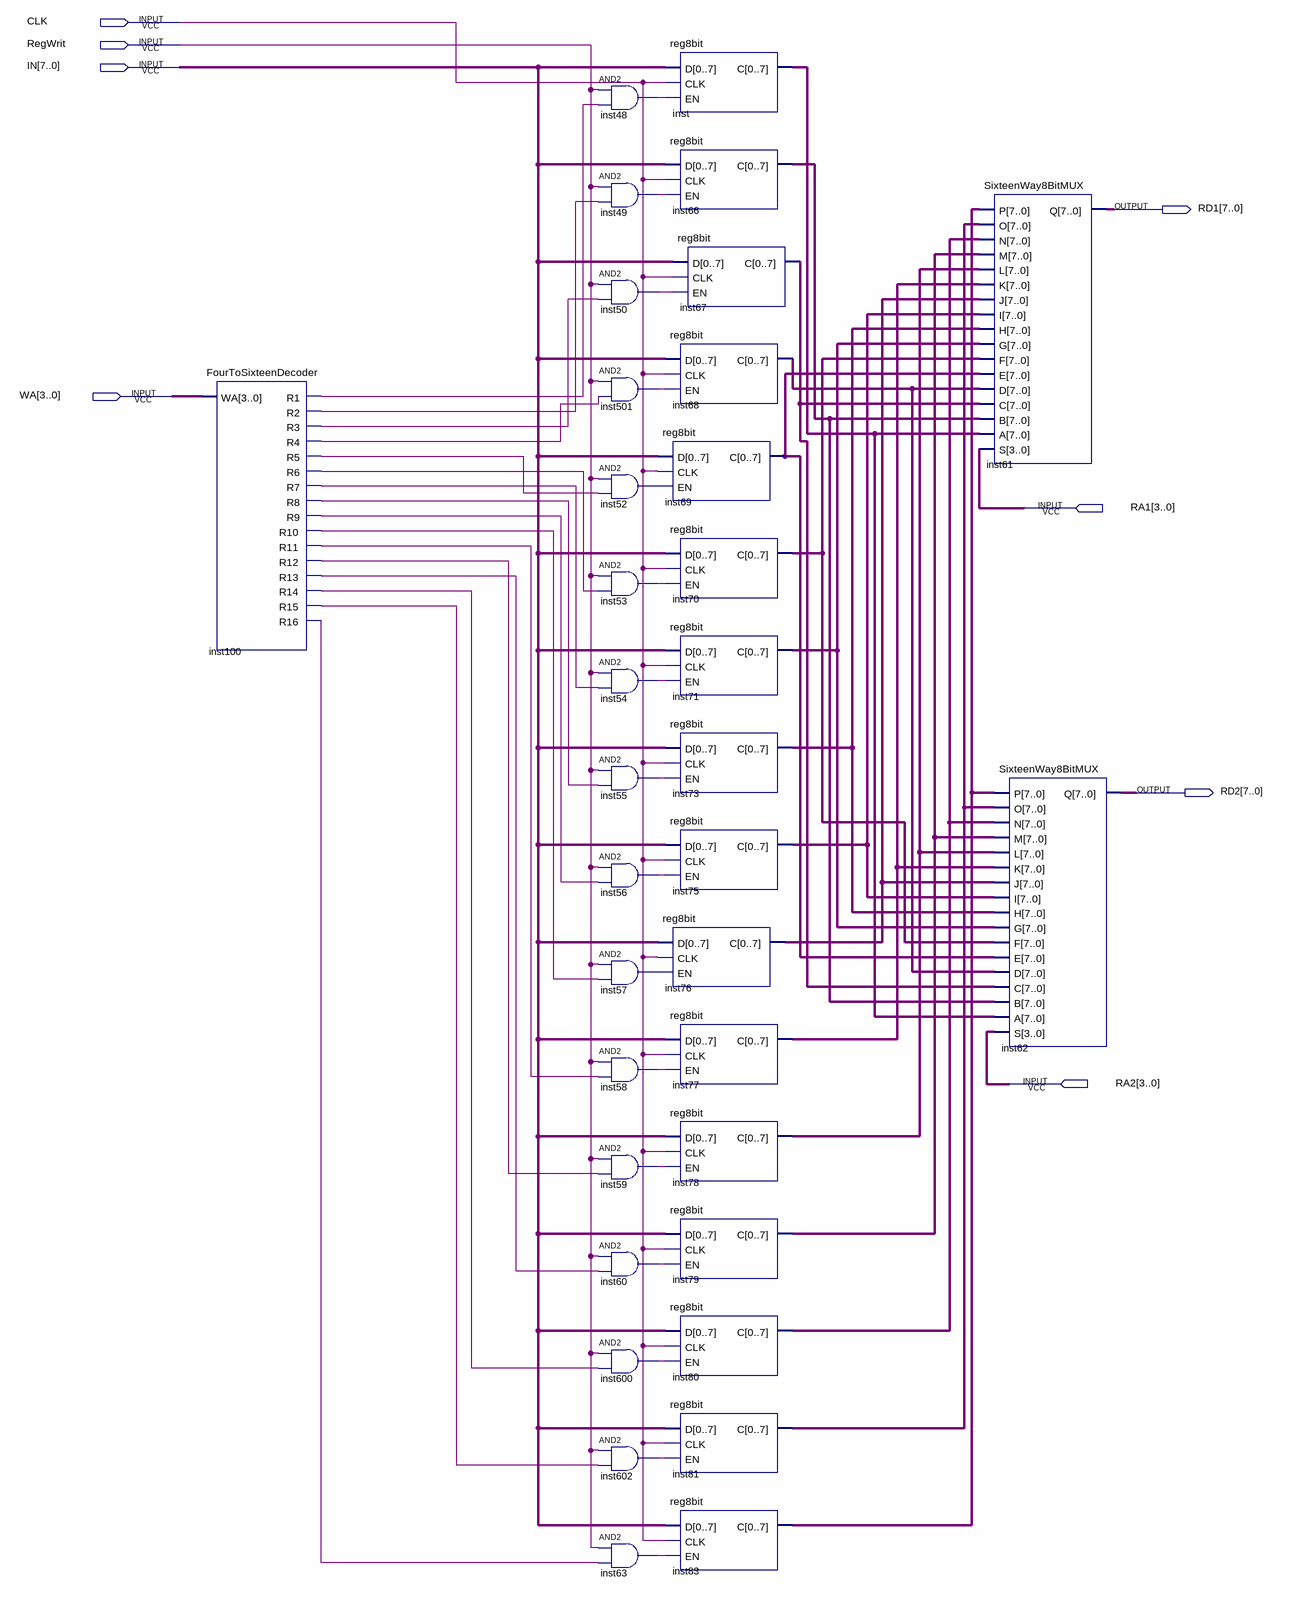
[diagram p0: schematic sheet]
// Quartus schematic SixteenByEightRF.bdf as structural Verilog: 35 symbols, 8 pins
module SixteenByEightRF (
  input  CLK,
  input  RegWrit,
  input  [7:0] IN,
  input  [3:0] WA,
  input  [3:0] RA1,
  input  [3:0] RA2,
  output [7:0] RD1,
  output [7:0] RD2
);

  wire inst48_out, inst49_out, inst50_out, inst52_out, inst53_out, inst54_out, inst55_out, inst56_out,
       inst57_out, inst58_out, inst59_out, inst60_out, inst63_out, inst100_r1, inst100_r2, inst100_r3,
       inst100_r4, inst100_r5, inst100_r6, inst100_r7, inst100_r8, inst100_r9, inst100_r10, inst100_r11,
       inst100_r12, inst100_r13, inst100_r14, inst100_r15, inst100_r16, inst501_out, inst600_out, inst602_out;
  wire [7:0] inst66_c, inst67_c, inst68_c, inst69_c, inst70_c, inst71_c, inst73_c, inst75_c, inst76_c,
       inst77_c, inst78_c, inst79_c, inst80_c, inst81_c, inst83_c, inst_c;

  FourToSixteenDecoder inst100 (
    .WA(WA), .R1(inst100_r1), .R2(inst100_r2), .R3(inst100_r3), .R4(inst100_r4), .R5(inst100_r5),
    .R6(inst100_r6), .R7(inst100_r7), .R8(inst100_r8), .R9(inst100_r9), .R10(inst100_r10), .R11(inst100_r11),
    .R12(inst100_r12), .R13(inst100_r13), .R14(inst100_r14), .R15(inst100_r15), .R16(inst100_r16));
  and inst48 (inst48_out, RegWrit, inst100_r1);
  and inst49 (inst49_out, RegWrit, inst100_r2);
  and inst50 (inst50_out, RegWrit, inst100_r3);
  and inst501 (inst501_out, RegWrit, inst100_r4);
  and inst52 (inst52_out, RegWrit, inst100_r5);
  and inst53 (inst53_out, RegWrit, inst100_r6);
  and inst54 (inst54_out, RegWrit, inst100_r7);
  and inst55 (inst55_out, RegWrit, inst100_r8);
  and inst56 (inst56_out, RegWrit, inst100_r9);
  and inst57 (inst57_out, RegWrit, inst100_r10);
  and inst58 (inst58_out, RegWrit, inst100_r11);
  and inst59 (inst59_out, RegWrit, inst100_r12);
  and inst60 (inst60_out, RegWrit, inst100_r13);
  and inst600 (inst600_out, RegWrit, inst100_r14);
  and inst602 (inst602_out, RegWrit, inst100_r15);
  and inst63 (inst63_out, RegWrit, inst100_r16);
  reg8bit inst69 (.D(IN), .CLK(CLK), .EN(inst52_out), .C(inst69_c));
  reg8bit inst76 (.D(IN), .CLK(CLK), .EN(inst57_out), .C(inst76_c));
  reg8bit inst (.D(IN), .CLK(CLK), .EN(inst48_out), .C(inst_c));
  reg8bit inst66 (.D(IN), .CLK(CLK), .EN(inst49_out), .C(inst66_c));
  reg8bit inst67 (.D(IN), .CLK(CLK), .EN(inst50_out), .C(inst67_c));
  reg8bit inst68 (.D(IN), .CLK(CLK), .EN(inst501_out), .C(inst68_c));
  reg8bit inst70 (.D(IN), .CLK(CLK), .EN(inst53_out), .C(inst70_c));
  reg8bit inst71 (.D(IN), .CLK(CLK), .EN(inst54_out), .C(inst71_c));
  reg8bit inst73 (.D(IN), .CLK(CLK), .EN(inst55_out), .C(inst73_c));
  reg8bit inst75 (.D(IN), .CLK(CLK), .EN(inst56_out), .C(inst75_c));
  reg8bit inst77 (.D(IN), .CLK(CLK), .EN(inst58_out), .C(inst77_c));
  reg8bit inst78 (.D(IN), .CLK(CLK), .EN(inst59_out), .C(inst78_c));
  reg8bit inst79 (.D(IN), .CLK(CLK), .EN(inst60_out), .C(inst79_c));
  reg8bit inst80 (.D(IN), .CLK(CLK), .EN(inst600_out), .C(inst80_c));
  reg8bit inst81 (.D(IN), .CLK(CLK), .EN(inst602_out), .C(inst81_c));
  reg8bit inst83 (.D(IN), .CLK(CLK), .EN(inst63_out), .C(inst83_c));
  SixteenWay8BitMUX inst61 (
    .P(inst83_c), .O(inst81_c), .N(inst80_c), .M(inst79_c), .L(inst78_c), .K(inst77_c), .J(inst76_c),
    .I(inst75_c), .H(inst73_c), .G(inst71_c), .F(inst70_c), .E(inst69_c), .D(inst68_c), .C(inst67_c),
    .B(inst66_c), .A(inst_c), .S(RA1), .Q(RD1));
  SixteenWay8BitMUX inst62 (
    .P(inst83_c), .O(inst81_c), .N(inst80_c), .M(inst79_c), .L(inst78_c), .K(inst77_c), .J(inst76_c),
    .I(inst75_c), .H(inst73_c), .G(inst71_c), .F(inst70_c), .E(inst69_c), .D(inst68_c), .C(inst67_c),
    .B(inst66_c), .A(inst_c), .S(RA2), .Q(RD2));
endmodule
